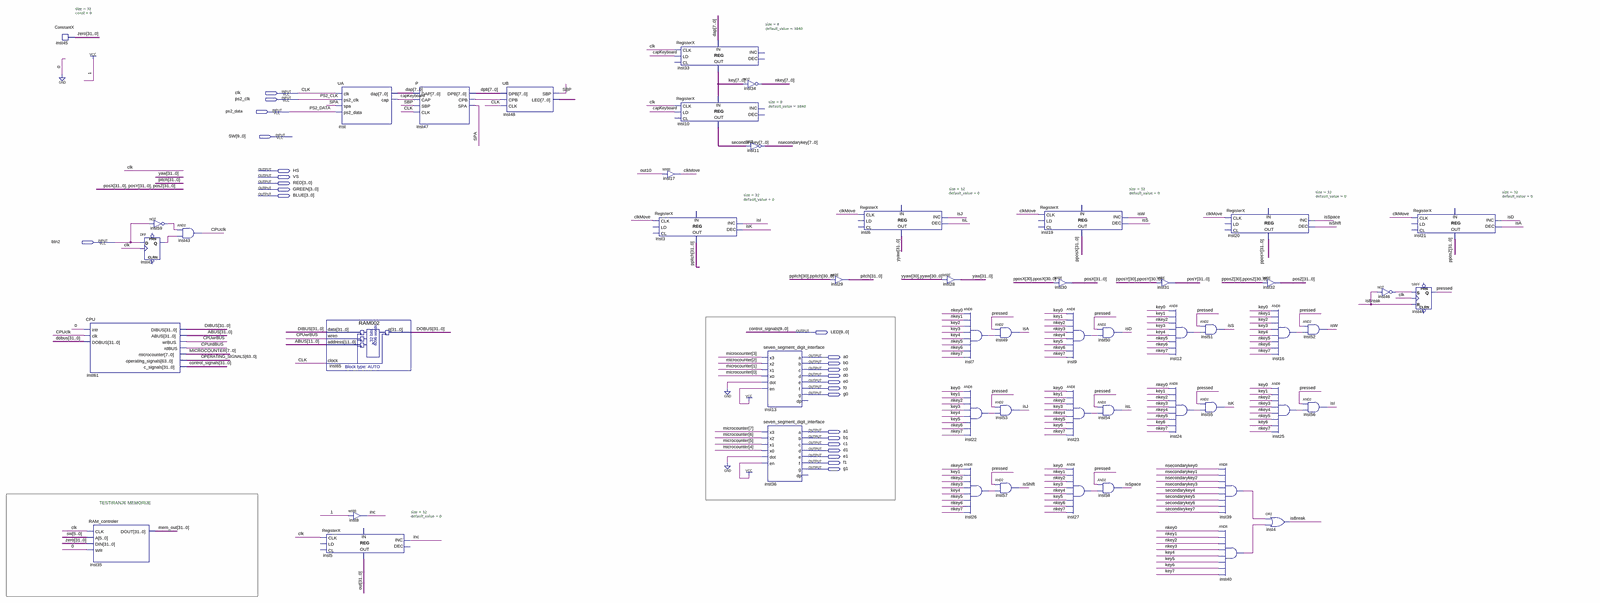
[diagram p0: schematic sheet, whole]
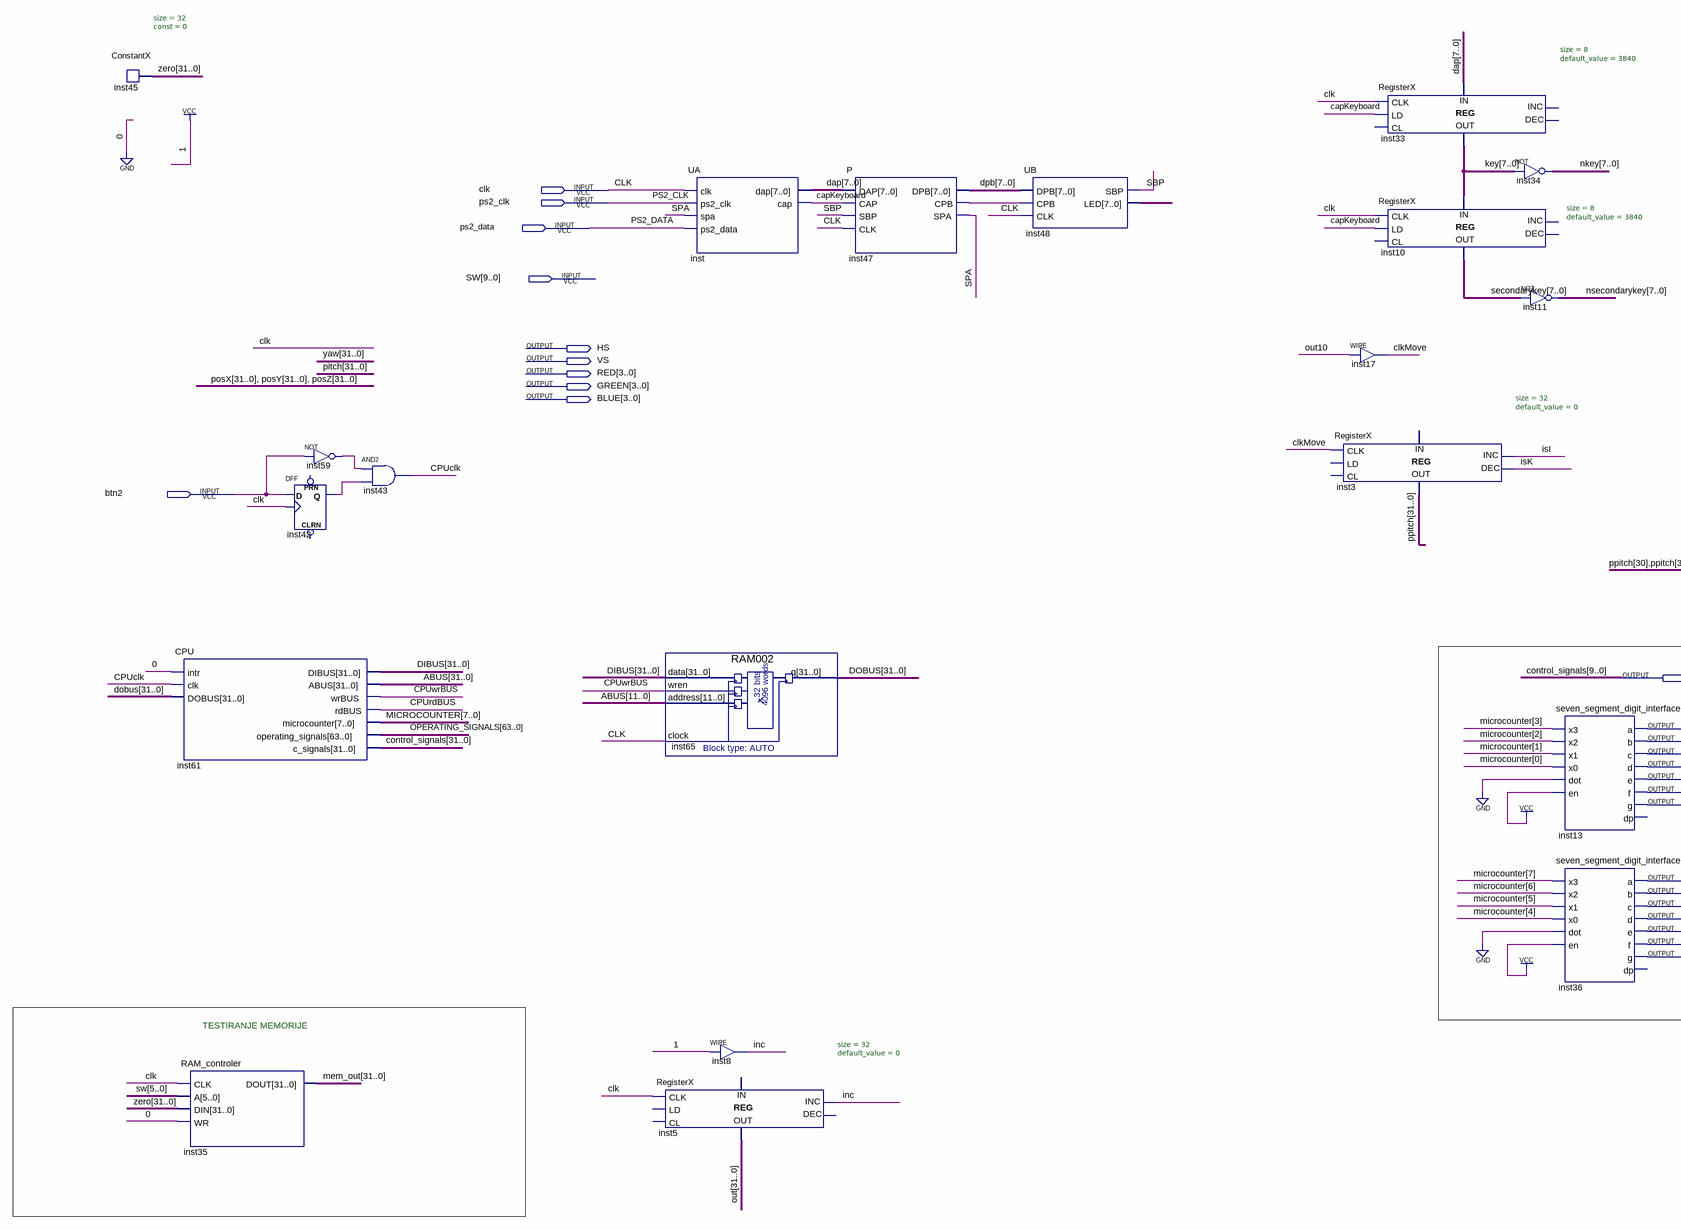
[diagram p1: schematic sheet, left part]
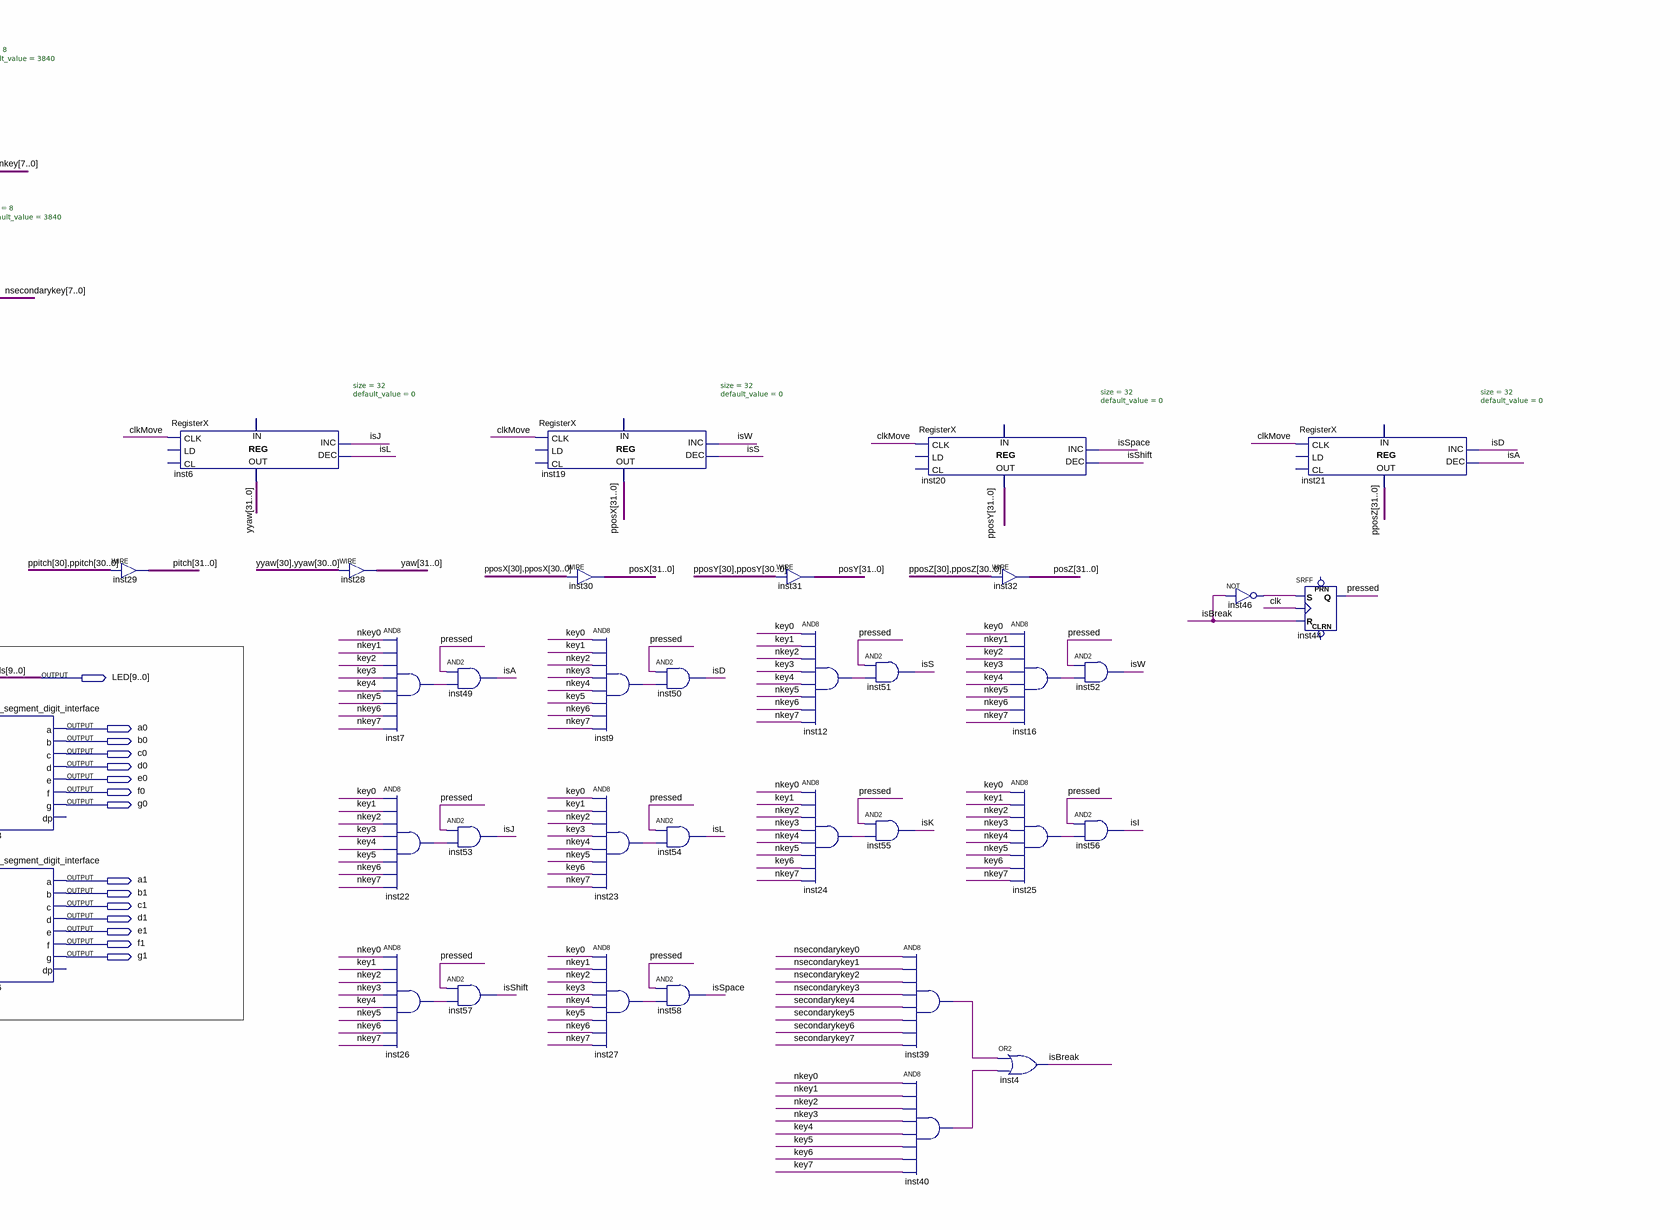
[diagram p2: schematic sheet, right part]
// Quartus schematic vga_keyboard.bdf as structural Verilog: 54 symbols, 25 pins
module vga_keyboard (
  input  clk,
  input  ps2_clk,
  input  ps2_data,
  input  [9:0] SW,
  input  btn2,
  output HS,
  output VS,
  output [3:0] RED,
  output [3:0] GREEN,
  output [3:0] BLUE,
  output [9:0] LED,
  output a0,
  output b0,
  output c0,
  output d0,
  output e0,
  output f0,
  output g0,
  output a1,
  output b1,
  output c1,
  output d1,
  output e1,
  output f1,
  output g1
);

  wire capKeyboard, clkMove, CPUclk, CPUrdBUS, CPUwrBUS, inc, inst7_out, inst9_out, inst12_out, inst16_out,
       inst22_out, inst23_out, inst24_out, inst25_out, inst26_out, inst27_out, inst39_out, inst40_out,
       inst42_q, inst46_out, inst47_cpb, inst59_out, isA, isBreak, isD, isI, isJ, isK, isL, isS, isShift,
       isSpace, isW, pressed, SBP, SPA;
  wire [7:0] dap, dpb, inst48_led, key, microcounter, nkey, nsecondarykey, secondarykey;
  wire [31:0] ABUS, DIBUS, dobus, mem_out, out, pitch, posX, posY, posZ, ppitch, pposX, pposY, pposZ, yaw,
       yyaw, zero;
  wire [31:10] control_signals;
  wire [63:0] OPERATING_SIGNALS;

  ConstantX #(.size(32), .\const (0)) inst45 (.DATA_OUT(zero));
  CPU inst61 (
    .intr(1'b0), .clk(CPUclk), .DOBUS(dobus), .DIBUS(DIBUS), .ABUS(ABUS), .wrBUS(CPUwrBUS), .rdBUS(CPUrdBUS),
    .microcounter(microcounter), .operating_signals(OPERATING_SIGNALS), .c_signals({control_signals, LED}));
  RAM_controler inst35 (.CLK(clk), .A(SW[5:0]), .DIN(zero), .WR(1'b0), .DOUT(mem_out));
  not inst59 (inst59_out, btn2);
  DFF inst42 (.CLK(clk), .D(btn2), .Q(inst42_q));  // open: CLRN, PRN
  and inst43 (CPUclk, inst59_out, inst42_q);
  UA inst (.clk(clk), .ps2_clk(ps2_clk), .spa(SPA), .ps2_data(ps2_data), .dap(dap), .cap(capKeyboard));
  RAM002 inst65 (.data(DIBUS), .wren(CPUwrBUS), .address(ABUS[11:0]), .clock(clk), .q(dobus));
  RegisterX #(.size(32), .default_value(0)) inst5 (.CLK(clk), .INC(inc), .DATA_OUT(out));  // open: LD, CL, DEC, DATA_IN
  assign inc = 1'b1;  // WIRE inst8
  P inst47 (.DAP(dap), .CAP(capKeyboard), .SBP(SBP), .CLK(clk), .DPB(dpb), .CPB(inst47_cpb), .SPA(SPA));
  UB inst48 (.DPB(dpb), .CPB(inst47_cpb), .CLK(clk), .SBP(SBP), .LED(inst48_led));
  RegisterX #(.size(32), .default_value(0)) inst3 (
    .CLK(clkMove), .INC(isI), .DEC(isK), .DATA_OUT(ppitch));  // open: LD, CL, DATA_IN
  RegisterX #(.size(8), .default_value(3840)) inst33 (
    .CLK(clk), .LD(capKeyboard), .DATA_IN(dap), .DATA_OUT(key));  // open: CL, INC, DEC
  RegisterX #(.size(8), .default_value(3840)) inst10 (
    .CLK(clk), .LD(capKeyboard), .DATA_IN(key), .DATA_OUT(secondarykey));  // open: CL, INC, DEC
  assign clkMove = out[10];  // WIRE inst17
  assign nkey = ~key;  // NOT inst34, 8 bits wide
  assign nsecondarykey = ~secondarykey;  // NOT inst11, 8 bits wide
  seven_segment_digit_interface inst13 (
    .x3(microcounter[3]), .x2(microcounter[2]), .x1(microcounter[1]), .x0(microcounter[0]), .dot(1'b0),
    .en(1'b1), .a(a0), .b(b0), .c(c0), .d(d0), .e(e0), .f(f0), .g(g0));  // open: dp
  seven_segment_digit_interface inst36 (
    .x3(microcounter[7]), .x2(microcounter[6]), .x1(microcounter[5]), .x0(microcounter[4]), .dot(1'b0),
    .en(1'b1), .a(a1), .b(b1), .c(c1), .d(d1), .e(e1), .f(f1), .g(g1));  // open: dp
  assign pitch = {{2{ppitch[30]}}, ppitch[29:0]};  // WIRE inst29
  RegisterX #(.size(32), .default_value(0)) inst6 (
    .CLK(clkMove), .INC(isJ), .DEC(isL), .DATA_OUT(yyaw));  // open: LD, CL, DATA_IN
  assign yaw = {{2{yyaw[30]}}, yyaw[29:0]};  // WIRE inst28
  and inst7 (inst7_out, nkey[0], nkey[1], key[2], key[3], key[4], nkey[5], nkey[6], nkey[7]);
  and inst22 (inst22_out, key[0], key[1], nkey[2], key[3], key[4], key[5], nkey[6], nkey[7]);
  and inst26 (inst26_out, nkey[0], key[1], nkey[2], nkey[3], key[4], nkey[5], nkey[6], nkey[7]);
  and inst49 (isA, pressed, inst7_out);
  and inst53 (isJ, pressed, inst22_out);
  and inst57 (isShift, pressed, inst26_out);
  RegisterX #(.size(32), .default_value(0)) inst19 (
    .CLK(clkMove), .INC(isW), .DEC(isS), .DATA_OUT(pposX));  // open: LD, CL, DATA_IN
  assign posX = {{2{pposX[30]}}, pposX[29:0]};  // WIRE inst30
  and inst9 (inst9_out, key[0], key[1], nkey[2], nkey[3], nkey[4], key[5], nkey[6], nkey[7]);
  and inst23 (inst23_out, key[0], key[1], nkey[2], key[3], nkey[4], nkey[5], key[6], nkey[7]);
  and inst27 (inst27_out, key[0], nkey[1], nkey[2], key[3], nkey[4], key[5], nkey[6], nkey[7]);
  and inst50 (isD, pressed, inst9_out);
  and inst54 (isL, pressed, inst23_out);
  and inst58 (isSpace, pressed, inst27_out);
  assign posY = {{2{pposY[30]}}, pposY[29:0]};  // WIRE inst31
  and inst12 (inst12_out, key[0], key[1], nkey[2], key[3], key[4], nkey[5], nkey[6], nkey[7]);
  and inst24 (inst24_out, nkey[0], key[1], nkey[2], nkey[3], nkey[4], nkey[5], key[6], nkey[7]);
  and inst51 (isS, pressed, inst12_out);
  and inst55 (isK, pressed, inst24_out);
  RegisterX #(.size(32), .default_value(0)) inst20 (
    .CLK(clkMove), .INC(isSpace), .DEC(isShift), .DATA_OUT(pposY));  // open: LD, CL, DATA_IN
  and inst39 (inst39_out, nsecondarykey[0], nsecondarykey[1], nsecondarykey[2], nsecondarykey[3], secondarykey[4], secondarykey[5], secondarykey[6], secondarykey[7]);
  and inst40 (inst40_out, nkey[0], nkey[1], nkey[2], nkey[3], key[4], key[5], key[6], key[7]);
  assign posZ = {{2{pposZ[30]}}, pposZ[29:0]};  // WIRE inst32
  and inst16 (inst16_out, key[0], nkey[1], key[2], key[3], key[4], nkey[5], nkey[6], nkey[7]);
  and inst25 (inst25_out, key[0], key[1], nkey[2], nkey[3], nkey[4], nkey[5], key[6], nkey[7]);
  or inst4 (isBreak, inst39_out, inst40_out);
  and inst52 (isW, pressed, inst16_out);
  and inst56 (isI, pressed, inst25_out);
  not inst46 (inst46_out, isBreak);
  RegisterX #(.size(32), .default_value(0)) inst21 (
    .CLK(clkMove), .INC(isD), .DEC(isA), .DATA_OUT(pposZ));  // open: LD, CL, DATA_IN
  SRFF inst44 (.S(inst46_out), .R(isBreak), .CLK(clk), .Q(pressed));  // open: PRN, CLRN

  // Other names for the same wires on the sheet: control_signals[9:0] = LED

  // Notes on the sheet:
  //   TESTIRANJE MEMORIJE
endmodule
